# Altium schematic sheet KitDemo.SchDoc
size A
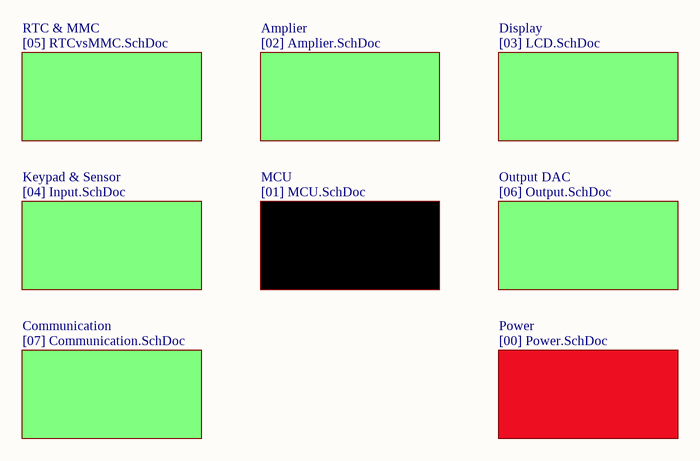
[diagram p0: KitDemo.SchDoc]

## Sub-sheets
Amplier = [02] Amplier.SchDoc: no entries
Communication = [07] Communication.SchDoc: no entries
Display = [03] LCD.SchDoc: no entries
Keypad & Sensor = [04] Input.SchDoc: no entries
MCU = [01] MCU.SchDoc: no entries
Output DAC = [06] Output.SchDoc: no entries
Power = [00] Power.SchDoc: no entries
RTC & MMC = [05] RTCvsMMC.SchDoc: no entries